# EAGLE schematic digitalclock (EAGLE 7.5.0)
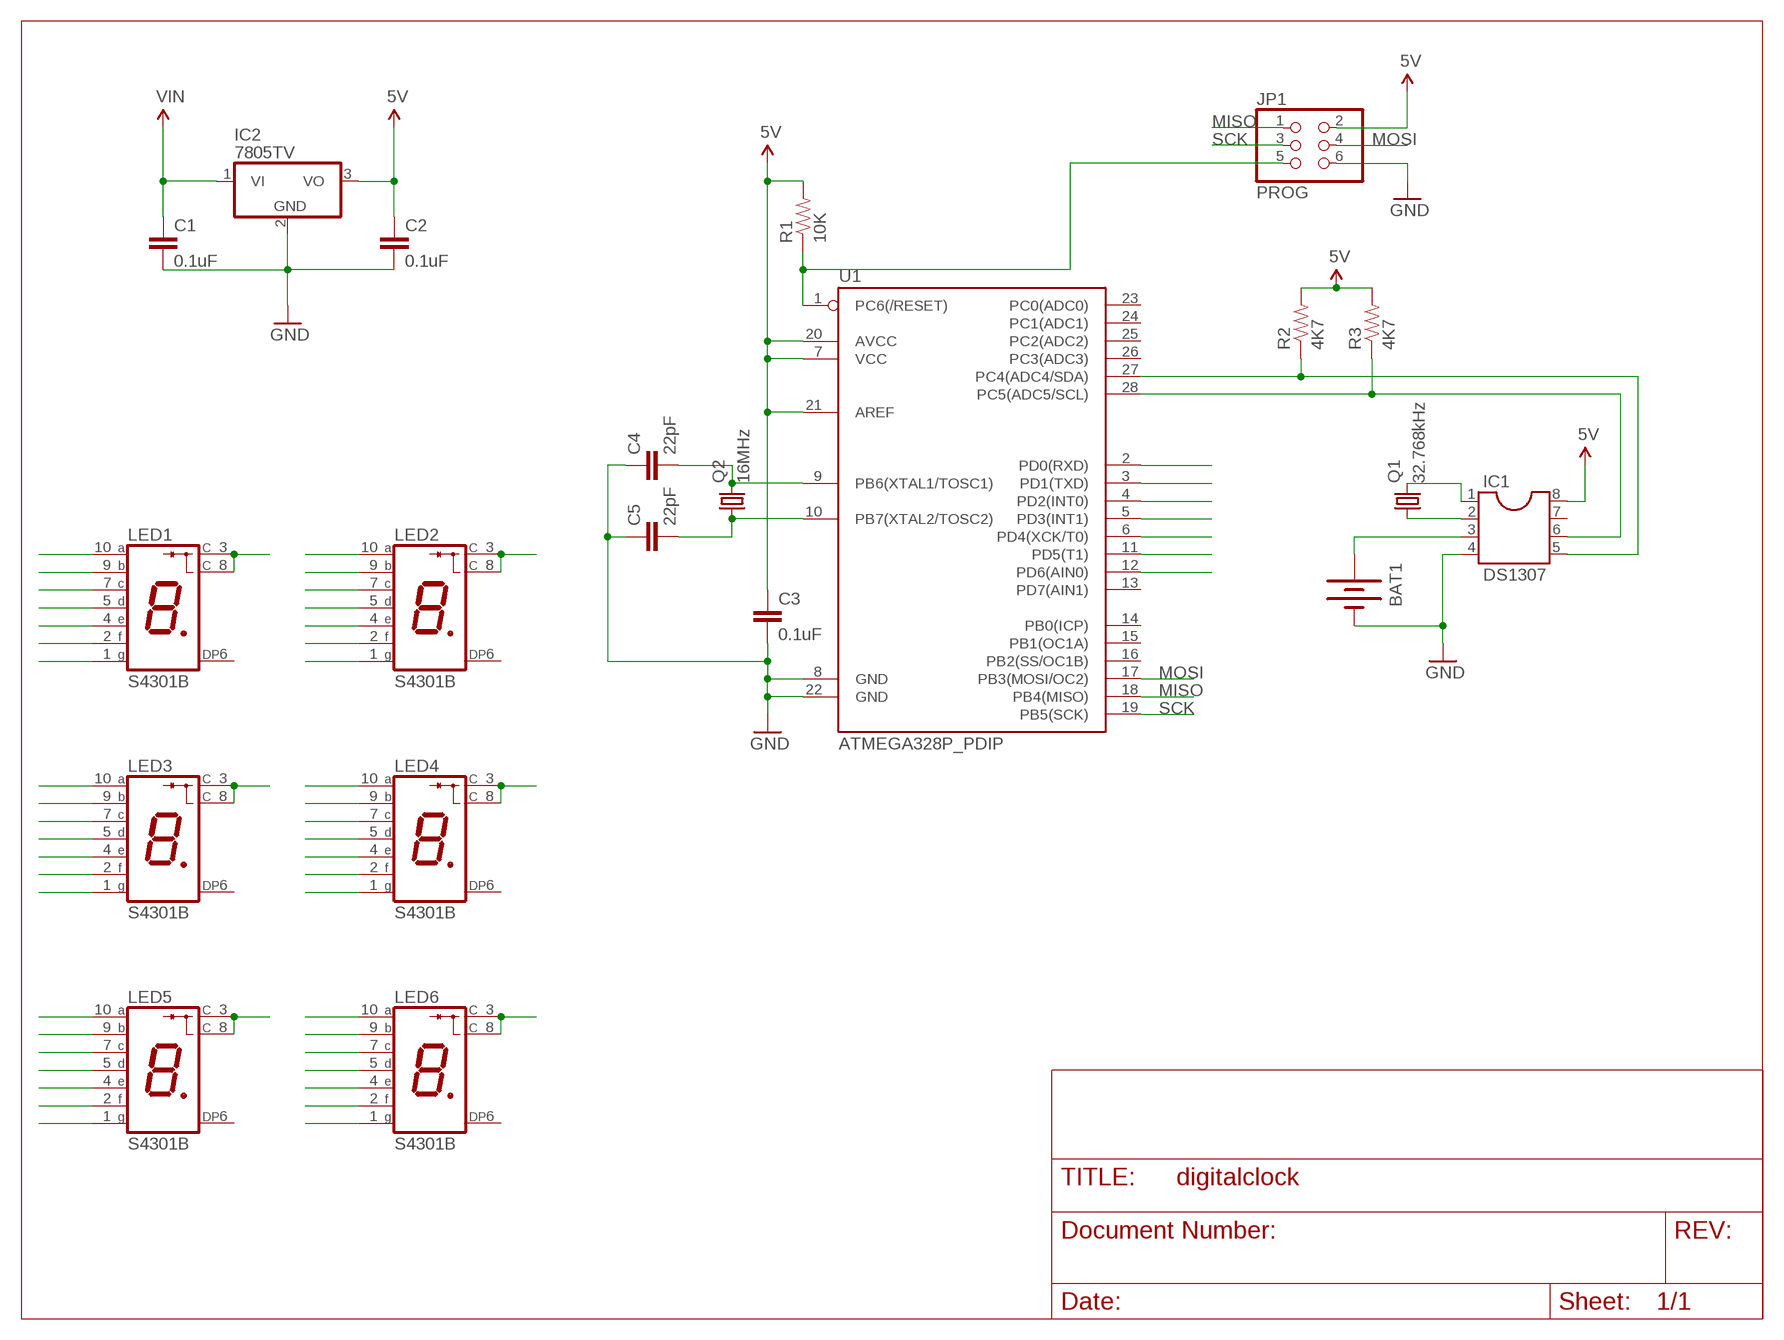
[diagram p0: schematic, sheet 1]

## Parts
BAT1  BATTERY20PTH  [BATTCOM_20MM_PTH]
C1  0.1uF  CAPPTH  [CAP-PTH-SMALL]
C2  0.1uF  CAPPTH  [CAP-PTH-SMALL]
C3  0.1uF  CAPPTH  [CAP-PTH-SMALL]
C4  22pF  CAPPTH  [CAP-PTH-SMALL]
C5  22pF  CAPPTH  [CAP-PTH-SMALL]
IC1  DS1307  DIL8S  [SOCKET-08]
IC2  7805TV  [TO220V]
JP1  PROG  PINHD-2X3  [2X03]
LED1  S4301B  [S4301B]
LED2  S4301B  [S4301B]
LED3  S4301B  [S4301B]
LED4  S4301B  [S4301B]
LED5  S4301B  [S4301B]
LED6  S4301B  [S4301B]
Q1  32.768kHz  CRYSTALTC26V  [TC26V]
Q2  16MHz  CRYSTALHC49S  [HC49/S]
R1  10K  RESISTORAXIAL-0.3  [AXIAL-0.3]
R2  4K7  RESISTORAXIAL-0.3  [AXIAL-0.3]
R3  4K7  RESISTORAXIAL-0.3  [AXIAL-0.3]
U1  ATMEGA328P_PDIP  [DIL28-3]

## Nets
5V: C2.1 C3.1 IC1.8 IC2.3(VO) JP1.2 R1.P$2 R2.P$2 R3.P$2 U1.7(VCC) U1.20(AVCC) U1.21(AREF)
GND: BAT1.2(-) C1.2 C2.2 C3.2 C4.1 C5.1 IC1.4 IC2.2(GND) JP1.6 U1.8(GND) U1.22(GND)
MISO: JP1.1 U1.18(PB4(MISO))
MOSI: JP1.4 U1.17(PB3(MOSI/OC2))
N$1: C4.2 Q2.2 U1.9(PB6(XTAL1/TOSC1))
N$2: C5.2 Q2.1 U1.10(PB7(XTAL2/TOSC2))
N$3: BAT1.1(+) IC1.3
N$4: U1.2(PD0(RXD))
N$5: U1.3(PD1(TXD))
N$6: IC1.2 Q1.1
N$7: IC1.1 Q1.2
N$8: IC1.6 R3.P$1 U1.28(PC5(ADC5/SCL))
N$9: IC1.5 R2.P$1 U1.27(PC4(ADC4/SDA))
N$10: U1.4(PD2(INT0))
N$11: JP1.5 R1.P$1 U1.1(PC6(/RESET))
N$12: U1.5(PD3(INT1))
N$13: U1.6(PD4(XCK/T0))
N$14: U1.11(PD5(T1))
N$15: U1.12(PD6(AIN0))
N$16: LED1.3(C) LED1.8(C)
N$17: LED2.3(C) LED2.8(C)
N$18: LED1.10(A)
N$19: LED1.9(B)
N$20: LED1.7(C)
N$21: LED1.5(D)
N$22: LED1.4(E)
N$23: LED1.2(F)
N$24: LED1.1(G)
N$25: LED2.1(G)
N$26: LED2.2(F)
N$27: LED2.4(E)
N$28: LED2.5(D)
N$29: LED2.7(C)
N$30: LED2.9(B)
N$31: LED2.10(A)
N$32: LED3.3(C) LED3.8(C)
N$33: LED4.3(C) LED4.8(C)
N$34: LED3.10(A)
N$35: LED3.9(B)
N$36: LED3.7(C)
N$37: LED3.5(D)
N$38: LED3.4(E)
N$39: LED3.2(F)
N$40: LED3.1(G)
N$41: LED4.1(G)
N$42: LED4.2(F)
N$43: LED4.4(E)
N$44: LED4.5(D)
N$45: LED4.7(C)
N$46: LED4.9(B)
N$47: LED4.10(A)
N$48: LED5.3(C) LED5.8(C)
N$49: LED6.3(C) LED6.8(C)
N$50: LED5.10(A)
N$51: LED5.9(B)
N$52: LED5.7(C)
N$53: LED5.5(D)
N$54: LED5.4(E)
N$55: LED5.2(F)
N$56: LED5.1(G)
N$57: LED6.1(G)
N$58: LED6.2(F)
N$59: LED6.4(E)
N$60: LED6.5(D)
N$61: LED6.7(C)
N$62: LED6.9(B)
N$63: LED6.10(A)
SCK: JP1.3 U1.19(PB5(SCK))
VIN: C1.1 IC2.1(VI)
Unconnected: IC1.7 LED1.6(DP) LED2.6(DP) LED3.6(DP) LED4.6(DP) LED5.6(DP) LED6.6(DP) U1.13(PD7(AIN1)) U1.14(PB0(ICP)) U1.15(PB1(OC1A)) U1.16(PB2(SS/OC1B)) U1.23(PC0(ADC0)) U1.24(PC1(ADC1)) U1.25(PC2(ADC2)) U1.26(PC3(ADC3))

## Library data of the parts
BAT1 = SparkFun-Electromechanical:BATTERY: Battery Holders Various common sizes : AA, AAA, 18650 (PRT-12895), 20mm coin cell and 12mm coin cell. 20MM_4LEGS, BATT-10373
C1-C5 = SparkFun-Capacitors:CAP: Capacitor Standard 0603 ceramic capacitor, and 0.1" leaded capacitor.
IC1 = ic-package:DIL8: Dual In Line / Socket
IC2 = linear:78*: Positive VOLTAGE REGULATOR Source: http://cache.national.com/ds/LM/LM78L05.pdf http://www.fairchildsemi.com/ds/LM/LM7805.pdf
JP1 = pinhead:PINHD-2X3: PIN HEADER
LED1-LED6 = led-7-segment:S4301B: Single Digit Seven-Segment Display (cathode common) Source: LITEON .. S4301B.pdf; OC_FARNELL: unknown; OC_NEWARK: unknown
Q1 = crystal:CRYSTAL: CRYSTAL; OC_FARNELL: unknown; OC_NEWARK: unknown
Q2 = crystal:CRYSTAL: CRYSTAL; OC_FARNELL: 1667008; OC_NEWARK: unknown
R1-R3 = SparkFun-Resistors:RESISTOR: Resistor Basic schematic elements and footprints for 0603, 1206, and PTH resistors.
U1 = SparkFun-DigitalIC:ATMEGA328P_PDIP: uC used in the Arduino 32kb flash, 1k EEPROM, 2k SRAM This is the through-hole version of this chip.